# EAGLE design Cartev2 (EAGLE 6.5.0)
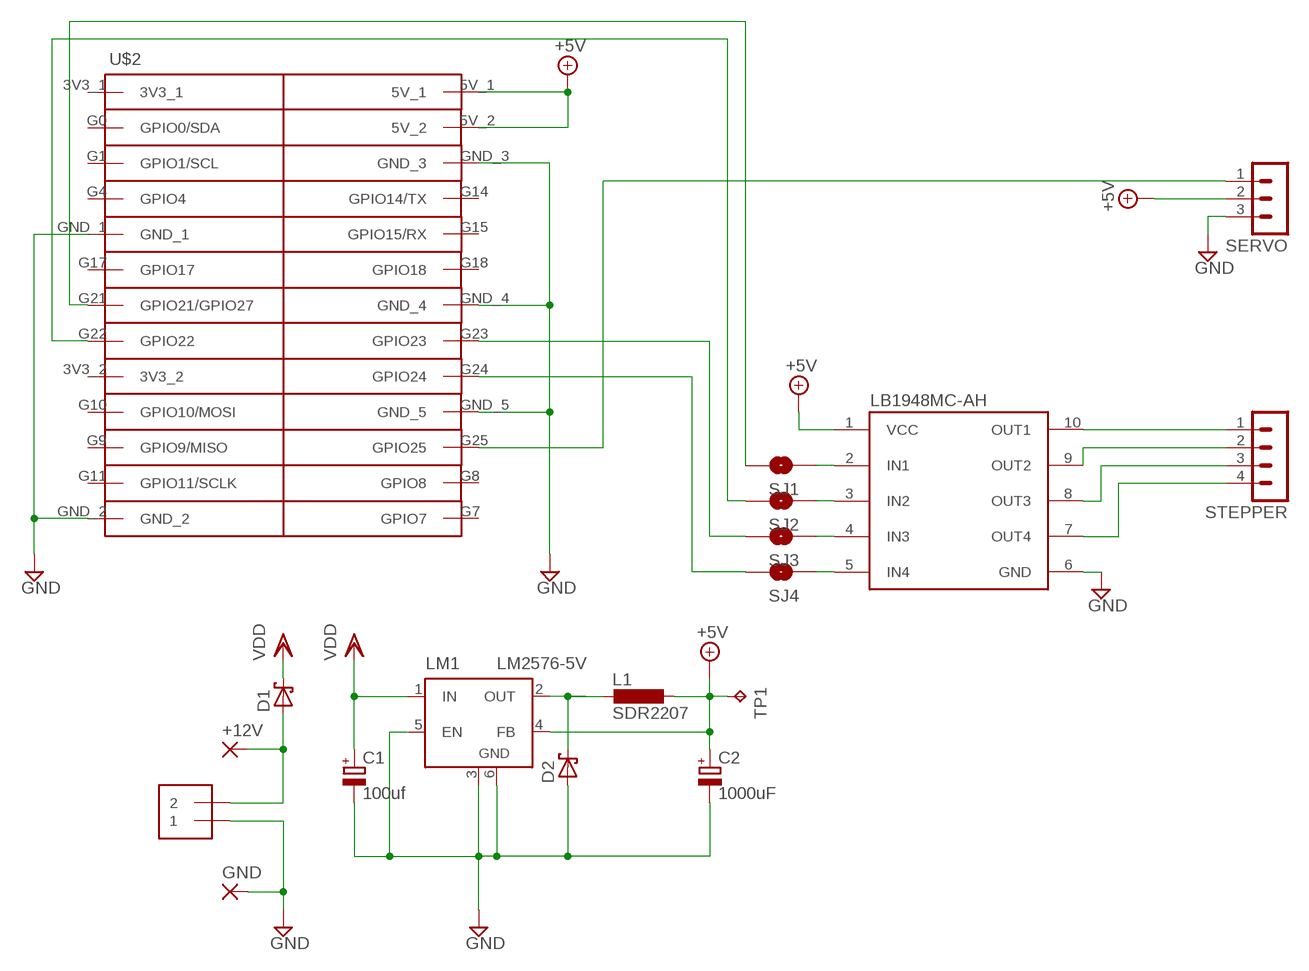
[diagram p0: schematic, sheet 1]

## Parts
+12V  3,81/1,4  [3,81/1,4]
C1  100uf  CPOL-EUE  [PANASONIC_E]
C2  1000uF  CPOL-EUG  [PANASONIC_G]
D1  SCHOTTKY-DIODESMC  [SMC]
D2  SCHOTTKY-DIODESMC  [SMC]
GND  3,81/1,4  [3,81/1,4]
J1  1X2-3.5MM  [3.5MMTERM]
L1  SDR2207  [SM]
LB1948MC-AH  LB1948MC-AH  [SOIC-10]
LM1  LM2576-5V  LM2596S  [TO263-5]
SERVO  MA03-1  [MA03-1]
SJ1  SOLDERJUMPERTRACE  [SJ_2S-TRACE]
SJ2  SOLDERJUMPERTRACE  [SJ_2S-TRACE]
SJ3  SOLDERJUMPERTRACE  [SJ_2S-TRACE]
SJ4  SOLDERJUMPERTRACE  [SJ_2S-TRACE]
STEPPER  MA04-1  [MA04-1]
TP1  TPTP10SQ  [TP10SQ]
U$2  CONNECTEUR_RPI  [26PIN]

## Nets
+5V: C2.+ L1.P$2 LB1948MC-AH.1(VCC) LM1.4(FB) SERVO.2 TP1.TP U$2.5V_1 U$2.5V_2
GND: C1.- C2.- D2.A GND.1(P) J1.1 LB1948MC-AH.6(GND) LM1.3(GND) LM1.5(EN) LM1.6(GND) SERVO.3 U$2.GND_1 U$2.GND_2 U$2.GND_3 U$2.GND_4 U$2.GND_5
N$1: LB1948MC-AH.10(OUT1) STEPPER.1
N$2: LB1948MC-AH.9(OUT2) STEPPER.2
N$3: LB1948MC-AH.8(OUT3) STEPPER.3
N$4: LB1948MC-AH.7(OUT4) STEPPER.4
N$5: +12V.1(P) D1.A J1.2
N$6: D2.C L1.P$1 LM1.2(OUT)
N$7: LB1948MC-AH.2(IN1) SJ1.1
N$8: LB1948MC-AH.3(IN2) SJ2.1
N$9: LB1948MC-AH.4(IN3) SJ3.1
N$10: LB1948MC-AH.5(IN4) SJ4.1
N$11: SERVO.1 U$2.G25(GPIO25)
N$12: SJ1.2 U$2.G21(GPIO21/GPIO27)
N$13: SJ2.2 U$2.G22(GPIO22)
N$14: SJ3.2 U$2.G23(GPIO23)
N$15: SJ4.2 U$2.G24(GPIO24)
VDD: C1.+ D1.C LM1.1(IN)
Unconnected: U$2.3V3_1 U$2.3V3_2 U$2.G0(GPIO0/SDA) U$2.G1(GPIO1/SCL) U$2.G4(GPIO4) U$2.G7(GPIO7) U$2.G8(GPIO8) U$2.G9(GPIO9/MISO) U$2.G10(GPIO10/MOSI) U$2.G11(GPIO11/SCLK) U$2.G14(GPIO14/TX) U$2.G15(GPIO15/RX) U$2.G17(GPIO17) U$2.G18(GPIO18)

## Library data of the parts
+12V GND = wirepad:3,81/1,4: THROUGH-HOLE PAD
C1 C2 = rcl:CPOL-EU: POLARIZED CAPACITOR, European symbol
D1 D2 = diode:SCHOTTKY-DIODE: Schottky Diode
J1 = adafruit (2):1X2: 3.5mm Terminal block http://www.ladyada.net/library/pcb/eaglelibrary.html
L1 = bourns-inductor:SDR2207
LB1948MC-AH = LB1948MC:LB1948MC-AH
LM1 = linear:LM2596S: STEP-DOWN VOLTAGE REGULATOR
SERVO = con-lstb:MA03-1: PIN HEADER; OC_FARNELL: unknown; OC_NEWARK: unknown
SJ1-SJ4 = SparkFun-Passives:SOLDERJUMPER: Solder Jumper Standard SMD solder jumper. Used to automate production. Two varients : Normally Open and Normally Closed are the same, but have different paste layers. NC will have a large amount of paste and should jumper during reflow.
STEPPER = con-lstb:MA04-1: PIN HEADER; OC_FARNELL: unknown; OC_NEWARK: unknown
TP1 = testpad:TP: Test pad
U$2 = Rpi:CONNECTEUR_RPI

## Board
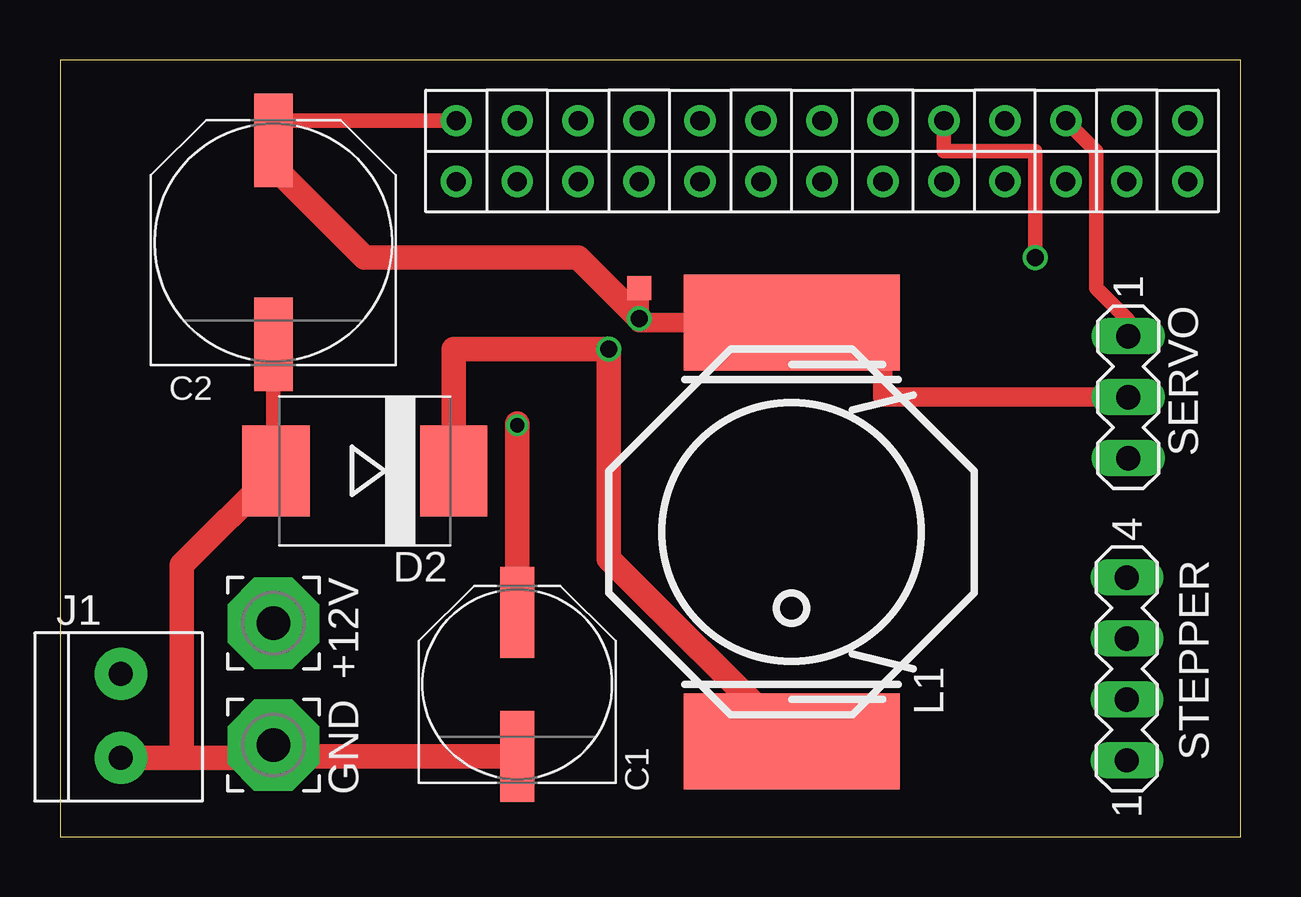
[diagram p1: board, top side]
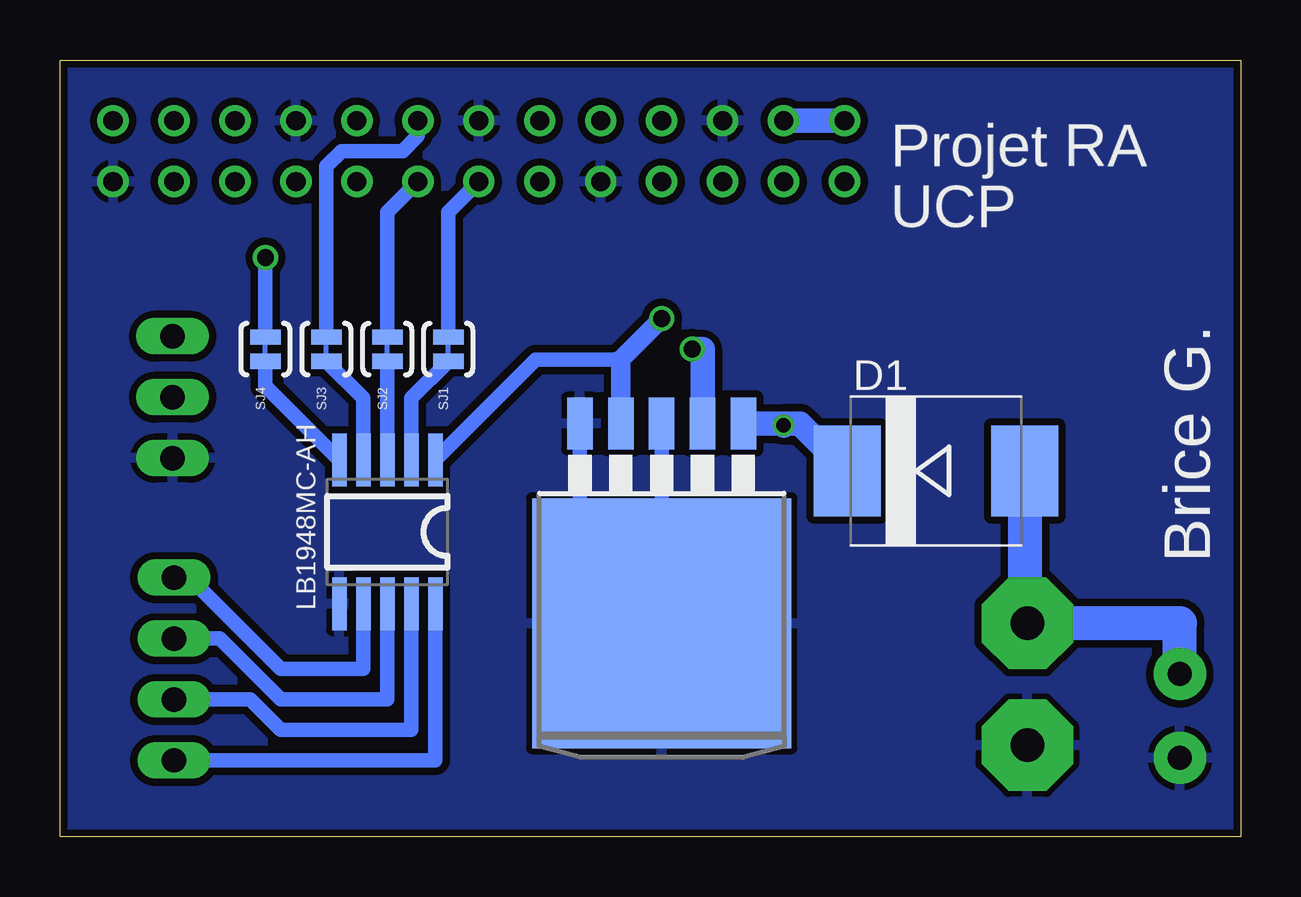
[diagram p2: board, bottom side, seen from below]

Size 49.2 x 32.38 mm. Coordinates in mm from the lower left corner, seen from the top.
Outline: 0,0 49.2,0 49.2,32.38 0,32.38 0,0
Copper layers (1*16): Top 0.035mm / dielectric 1.5mm / Bottom 0.035mm
Design rules "ITEADstudio_DRC": minimum track width 6mil, minimum drill 12mil, track to track 6mil, track to pad 6mil, pad to pad 6mil, via to via 6mil, smd to smd 0mil, copper to edge 10mil, drill to drill 10mil, minimum pad ring 10mil, minimum via ring 6mil, stop-mask expansion 2mil, vias tented up to drill 100mil, thermal gap 10mil
bRestrict: area 22.9,16.5 to 25.4,19.1

### Footprints (pad centres in the part's own frame; a part is rotated, then mirrored left to right if it is on the bottom)
3,81/1,4 = drill 1.397 pad 3.81 octagon: 1 0,0
PANASONIC_E = smd 3.8 x 1.4: + 3,0; - -3,0
PANASONIC_G = smd 3.9 x 1.6: + 4.25,0; - -4.25,0
SMC = smd 2.8 x 3.8: A 3.7,0; C -3.7,0
3.5MMTERM = drill 1 pad 2.184: 1 1.8,0; 2 -1.7,0
SM = smd 4 x 9: P$1 -8.74,0; P$2 8.72,0
SOIC-10 = smd 2.2 x 0.6: 1 -3,2; 2 -3,1; 3 -3,0; 4 -3,-1; 5 -3,-2; 6 3,-2; 7 3,-1; 8 3,0; 9 3,1; 10 3,2
TO263-5 = smd 1.067 x 2.159: 1 -3.404,-5.791; 2 -1.702,-5.791; 3 0,-5.791; 4 1.702,-5.791; 5 3.404,-5.791 | smd 10.8 x 10.41: 6 0,2.54
MA03-1 = drill 1.016 long: 1 -2.54,0; 2 0,0; 3 2.54,0
SJ_2S-TRACE = smd 0.635 x 1.27: 1 -0.508,0; 2 0.508,0
MA04-1 = drill 1.016 long: 1 -3.81,0; 2 -1.27,0; 3 1.27,0; 4 3.81,0
TP10SQ = smd 1 x 1: TP 0,0
26PIN = drill 0.8: 3V3_1 -1.27,15.24; 3V3_2 -1.27,-5.08; 5V_1 1.27,15.24; 5V_2 1.27,12.7; G0 -1.27,12.7; G1 -1.27,10.16; G4 -1.27,7.62; G7 1.27,-15.24; G8 1.27,-12.7; G9 -1.27,-10.16; G10 -1.27,-7.62; G11 -1.27,-12.7; G14 1.27,7.62; G15 1.27,5.08; G17 -1.27,2.54; G18 1.27,2.54; G21 -1.27,0; G22 -1.27,-2.54; G23 1.27,-2.54; G24 1.27,-5.08; G25 1.27,-10.16; GND_1 -1.27,5.08; GND_2 -1.27,-15.24; GND_3 1.27,10.16; GND_4 1.27,0; GND_5 1.27,-7.62

### Placement (x,y rotation side)
+12V  8.89,8.89 270 top
C1  19.05,6.35 90 top
C2  8.89,24.77 90 top
D1  12.7,15.24 0 bottom
D2  12.7,15.24 180 top
GND  8.89,3.81 270 top
J1  2.54,5.08 270 top
L1  30.48,12.7 90 top
LB1948MC-AH  35.56,12.7 270 bottom
LM1  24.13,11.43 180 bottom
SERVO  44.51,18.32 270 top
SJ1  33.02,20.32 90 bottom
SJ2  35.56,20.32 90 bottom
SJ3  38.1,20.32 90 bottom
SJ4  40.64,20.32 90 bottom
STEPPER  44.45,6.99 90 top
TP1  24.13,22.86 90 top
U$2  31.75,28.57 90 top

### Tracks (layer width: path | path; a pad name or v marks a point on that pad's centre or on a via)
+5V  (via drill 0.7)
  Top 0.61: C2.+ 9.09,29.84 U$2.5V_1
  Top 0.813: 30.48,22.86 L1.P$2 | L1.P$2 24.13,21.42 v24.13,21.59 TP1.TP | SERVO.2 34.29,18.32 34.29,20.95 30.48,20.95 L1.P$2
  Top 1.016: v24.13,21.59 21.59,24.13 12.7,24.13 8.89,27.94 C2.+
  Bottom 0.61: LB1948MC-AH.1 29.37,19.89 25.83,19.89
  Bottom 0.813: v24.13,21.59 25.83,19.89 LM1.4
  Bottom 1.016: U$2.5V_2 U$2.5V_1
GND
  Top 0.61: C2.- 8.89,16.51 9,16.4 D2.A
  Top 1.016: C1.- 9.35,3.35 GND.1 8.36,3.28 5.08,3.28 | 5.08,3.28 J1.1 | D2.A 5.08,11.32 5.08,3.28
  Bottom 0.61: LM1.5 27.53,12.7 27.94,12.7 27.94,8.89 LM1.6 LM1.3
  pour Bottom (isolate 0.305): 50.8,33.02 -1.27,33.02 -1.27,-1.27 50.8,-1.27
N$1
  Bottom 0.61: STEPPER.1 33.56,3.17 LB1948MC-AH.10
N$2
  Bottom 0.61: STEPPER.2 41.27,5.71 40.01,4.45 34.56,4.45 LB1948MC-AH.9
N$3
  Bottom 0.61: STEPPER.3 42.55,8.26 40.01,5.71 35.56,5.71 LB1948MC-AH.8
N$4
  Bottom 0.61: STEPPER.4 43.81,10.79 40.01,6.99 36.56,6.99 LB1948MC-AH.7
N$5
  Bottom 1.422: J1.2 2.54,8.89 +12V.1 9,8.89 D1.A
N$6  (via drill 0.7)
  Top 1.016: D2.C 16.4,20.32 v22.86,20.32 22.86,11.58 L1.P$1
  Bottom 1.016: v22.86,20.32 22.43,20.32 LM1.2
N$7
  Bottom 0.61: LB1948MC-AH.2 34.56,18.27 SJ1.1
N$8
  Bottom 0.61: SJ2.1 LB1948MC-AH.3
N$9
  Bottom 0.61: LB1948MC-AH.4 36.56,18.27 SJ3.1
N$10
  Bottom 0.61: SJ4.1 40.64,18.78 LB1948MC-AH.5
N$11
  Top 0.61: U$2.G25 43.18,28.57 43.18,22.86 44.51,21.53 SERVO.1
N$12
  Bottom 0.61: SJ1.2 33.02,26.04 U$2.G21
N$13
  Bottom 0.61: SJ2.2 35.56,26.04 U$2.G22
N$14
  Bottom 0.61: SJ3.2 38.1,27.94 37.47,28.57 34.92,28.57 34.29,29.21 U$2.G23
N$15  (via drill 0.7)
  Top 0.61: v40.64,24.13 40.64,28.57 36.83,28.57 U$2.G24
  Bottom 0.61: SJ4.2 v40.64,24.13
VDD  (via drill 0.6)
  Top 1.016: C1.+ v19.05,17.14 19.05,17.22
  Bottom 1.016: LM1.1 18.97,17.22 | D1.C 18.38,17.22 18.97,17.22 | 18.97,17.22 v19.05,17.14

### Text on the board
bPlace: Projet RA | UCP | Brice G.